# Altium schematic sheet Atmel_circuit-2.SchDoc
size A
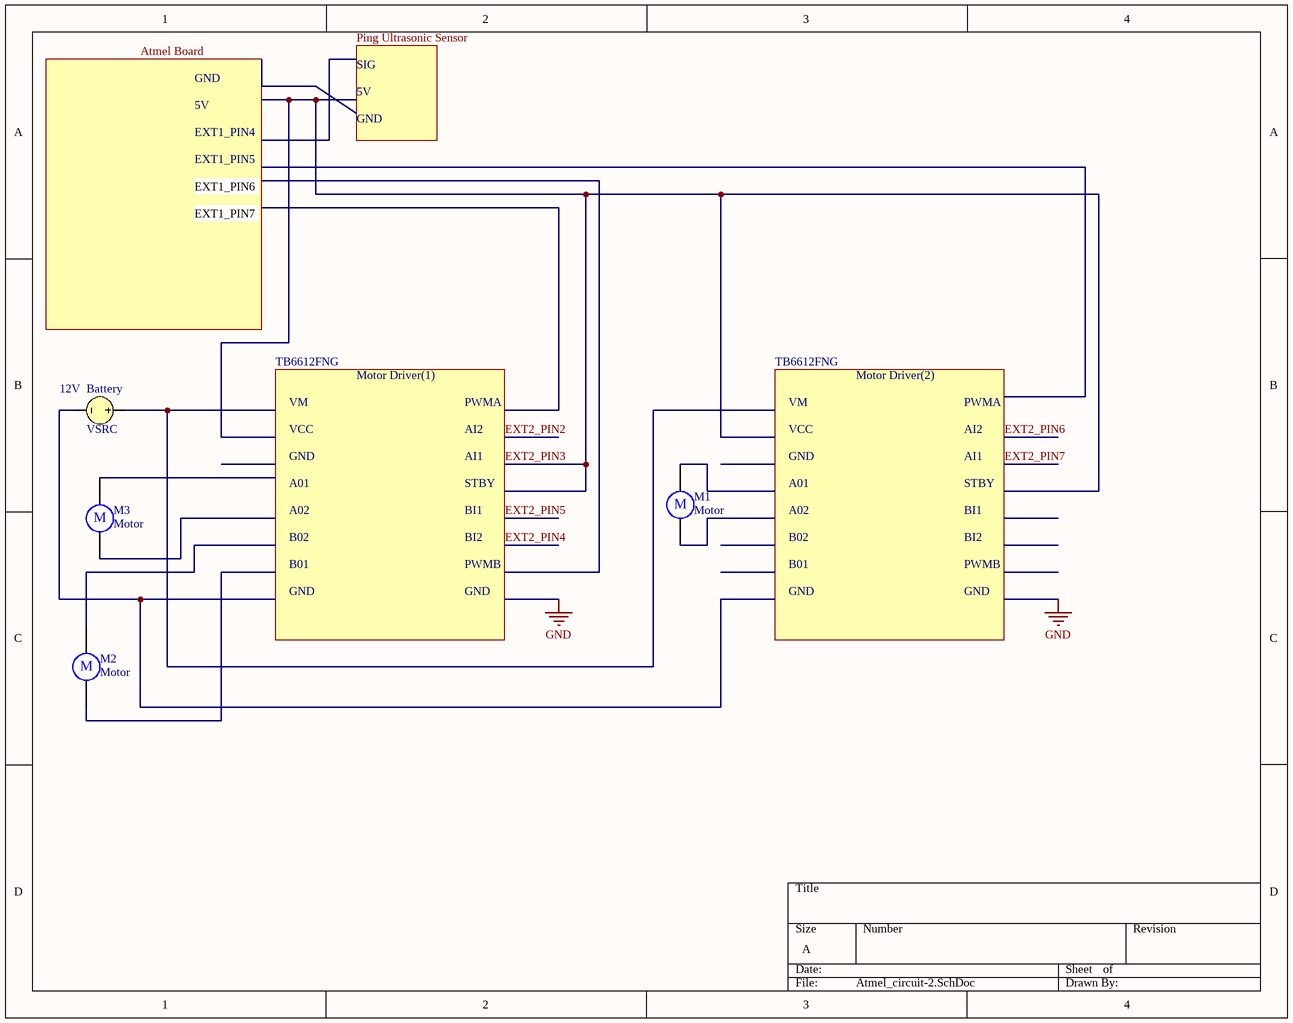
[diagram p0: Atmel_circuit-2.SchDoc]

## Parts
Battery  VSRC  value 12V
M1  Motor  [RB5-10.5]
M2  Motor  [RB5-10.5]
M3  Motor  [RB5-10.5]

## Nets

Not connected (* = marked no-connect by the designer): Battery 1 2; M1 1 2; M2 1 2; M3 1 2

## Notes on the sheet
- GND
- 5V
- SIG
- EXT1_PIN5
- EXT1_PIN4
- EXT1_PIN6
- EXT1_PIN7
- TB6612FNG
- VCC
- VM
- Motor Driver(1)
- PWMA
- AI2
- Motor Driver(2)
- A01
- AI1
- STBY
- A02
- B02
- B01
- BI1
- BI2
- PWMB
- Labels drawn without touching a wire or pin: Atmel Board, Ping Ultrasonic Sensor
- (in symbol Motor) M

## Library data of the parts
Battery = VSRC: Voltage Source; Note: PCB Footprint - Not required; Published: 8-Jun-2000; LatestRevisionDate: 17-Jul-2002; LatestRevisionNote: Re-released for DXP Platform.; PackageReference: Not Applicable; Publisher: Altium Limited
M1-M3 = Motor: Motor, General Kind; Published: 24-Mar-1999; LatestRevisionDate: 17-Jul-2002; LatestRevisionNote: Re-released for DXP Platform.; PackageReference: RB5-10.5; Publisher: Altium Limited; PackageDescription: Capacitor (Radial); 2 Leads